# Altium project JSP016RB.PrjPCB
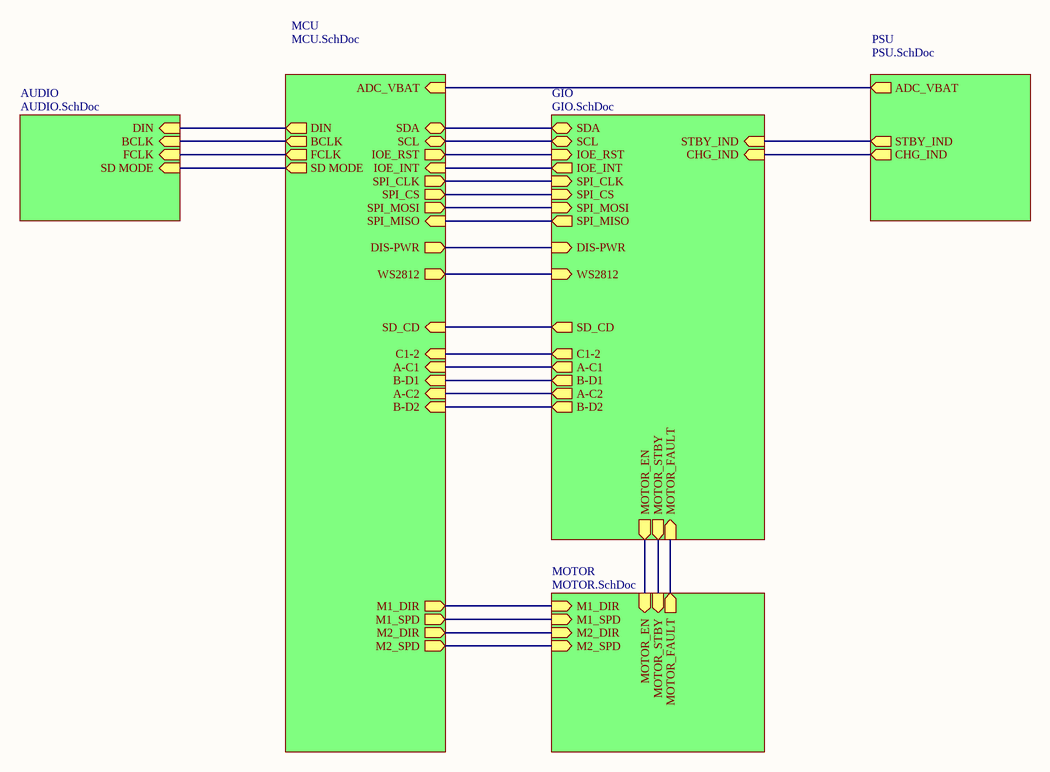
[diagram p0: JSP016.SchDoc]
6 sheets, 164 parts. Net scope: hierarchical (ports join the sheet entries above them; power ports are global).
Board file: JSP016RB.PcbDoc
Sheets:
  JSP016.SchDoc
    MCU = MCU.SchDoc
    AUDIO = AUDIO.SchDoc
    PSU = PSU.SchDoc
    MOTOR = MOTOR.SchDoc
    GIO = GIO.SchDoc

## Sheet JSP016.SchDoc: ROBOX V2 - General Overview
size A4; DrawnBy: Jan Stappers; DocumentNumber: JSP016; Revision: B; SheetNumber: 1; SheetTotal: 6

### Sub-sheets
AUDIO = AUDIO.SchDoc: BCLK (in), SD MODE (in), DIN (in), FCLK (in)
GIO = GIO.SchDoc: SD_CD (out), SPI_CLK (in), SCL (bidir), SPI_CS (in), STBY_IND (in), WS2812 (in), SDA (bidir), SPI_MOSI (in), SPI_MISO (out), IOE_RST (in), A-C1 (out), B-D1 (out), C1-2 (out), MOTOR_EN (out), DIS-PWR (in), MOTOR_STBY (out), CHG_IND (in), A-C2 (out), B-D2 (out), IOE_INT (out), MOTOR_FAULT (in)
MCU = MCU.SchDoc: FCLK (out), SD_CD (in), SPI_CLK (out), SDA (bidir), WS2812 (out), SPI_MISO (in), SPI_MOSI (out), SD MODE (out), SCL (bidir), DIN (out), DIS-PWR (out), BCLK (out), M1_DIR (out), M2_DIR (out), M2_SPD (out), M1_SPD (out), SPI_CS (out), IOE_RST (out), A-C1 (in), B-D1 (in), C1-2 (in), A-C2 (in), B-D2 (in), IOE_INT (in), ADC_VBAT (in)
MOTOR = MOTOR.SchDoc: M2_SPD (in), M2_DIR (in), M1_SPD (in), M1_DIR (in), MOTOR_STBY (in), MOTOR_EN (in), MOTOR_FAULT (out)
PSU = PSU.SchDoc: CHG_IND (out), STBY_IND (out), ADC_VBAT (out)

### Nets
DIS-PWR: sheet MCU/DIS-PWR, sheet GIO/DIS-PWR
NetC34_2: sheet MCU/ADC_VBAT, sheet PSU/ADC_VBAT
NetC49_1: sheet MOTOR/MOTOR_STBY, sheet GIO/MOTOR_STBY
NetIC1_1: sheet MCU/DIN, sheet AUDIO/DIN
NetIC1_4: sheet MCU/SD MODE, sheet AUDIO/SD MODE
NetIC1_14: sheet MCU/FCLK, sheet AUDIO/FCLK
NetIC1_16: sheet MCU/BCLK, sheet AUDIO/BCLK
NetIC3_4: sheet MCU/C1-2, sheet GIO/C1-2
NetIC3_5: sheet MCU/A-C2, sheet GIO/A-C2
NetIC3_6: sheet MCU/B-D2, sheet GIO/B-D2
NetIC3_7: sheet MCU/IOE_INT, sheet GIO/IOE_INT
NetIC3_9: sheet MCU/A-C1, sheet GIO/A-C1
NetIC3_10: sheet MCU/B-D1, sheet GIO/B-D1
NetIC3_22: sheet MCU/SD_CD, sheet GIO/SD_CD
NetIC3_25: sheet MCU/M1_DIR, sheet MOTOR/M1_DIR
NetIC3_26: sheet MCU/M2_DIR, sheet MOTOR/M2_DIR
NetIC3_29: sheet MCU/SPI_CS, sheet GIO/SPI_CS
NetIC3_30: sheet MCU/SPI_CLK, sheet GIO/SPI_CLK
NetIC3_31: sheet MCU/SPI_MOSI, sheet GIO/SPI_MOSI
NetIC3_32: sheet MCU/SPI_MISO, sheet GIO/SPI_MISO
NetIC3_33: sheet MCU/M1_SPD, sheet MOTOR/M1_SPD
NetIC3_34: sheet MCU/M2_SPD, sheet MOTOR/M2_SPD
NetIC8_6: sheet PSU/STBY_IND, sheet GIO/STBY_IND
NetIC8_7: sheet PSU/CHG_IND, sheet GIO/CHG_IND
NetIC10_3: sheet MCU/IOE_RST, sheet GIO/IOE_RST
NetIC10_15: sheet MOTOR/MOTOR_EN, sheet GIO/MOTOR_EN
NetIC10_17: sheet MOTOR/MOTOR_FAULT, sheet GIO/MOTOR_FAULT
NetIC10_22: sheet MCU/SCL, sheet GIO/SCL
NetIC10_23: sheet MCU/SDA, sheet GIO/SDA
NetIC11_1: sheet MCU/WS2812, sheet GIO/WS2812

### Notes on the sheet
- Title
- Size:
- Date:
- A4
- Number:
- Time:
- Revision:
- Sheet
- of
- File:

## Sheet MCU.SchDoc: ROBOX V2 - Microcontroller
size A4; DrawnBy: Jan Stappers; DocumentNumber: JSP016; Revision: B; SheetNumber: 2; SheetTotal: 6
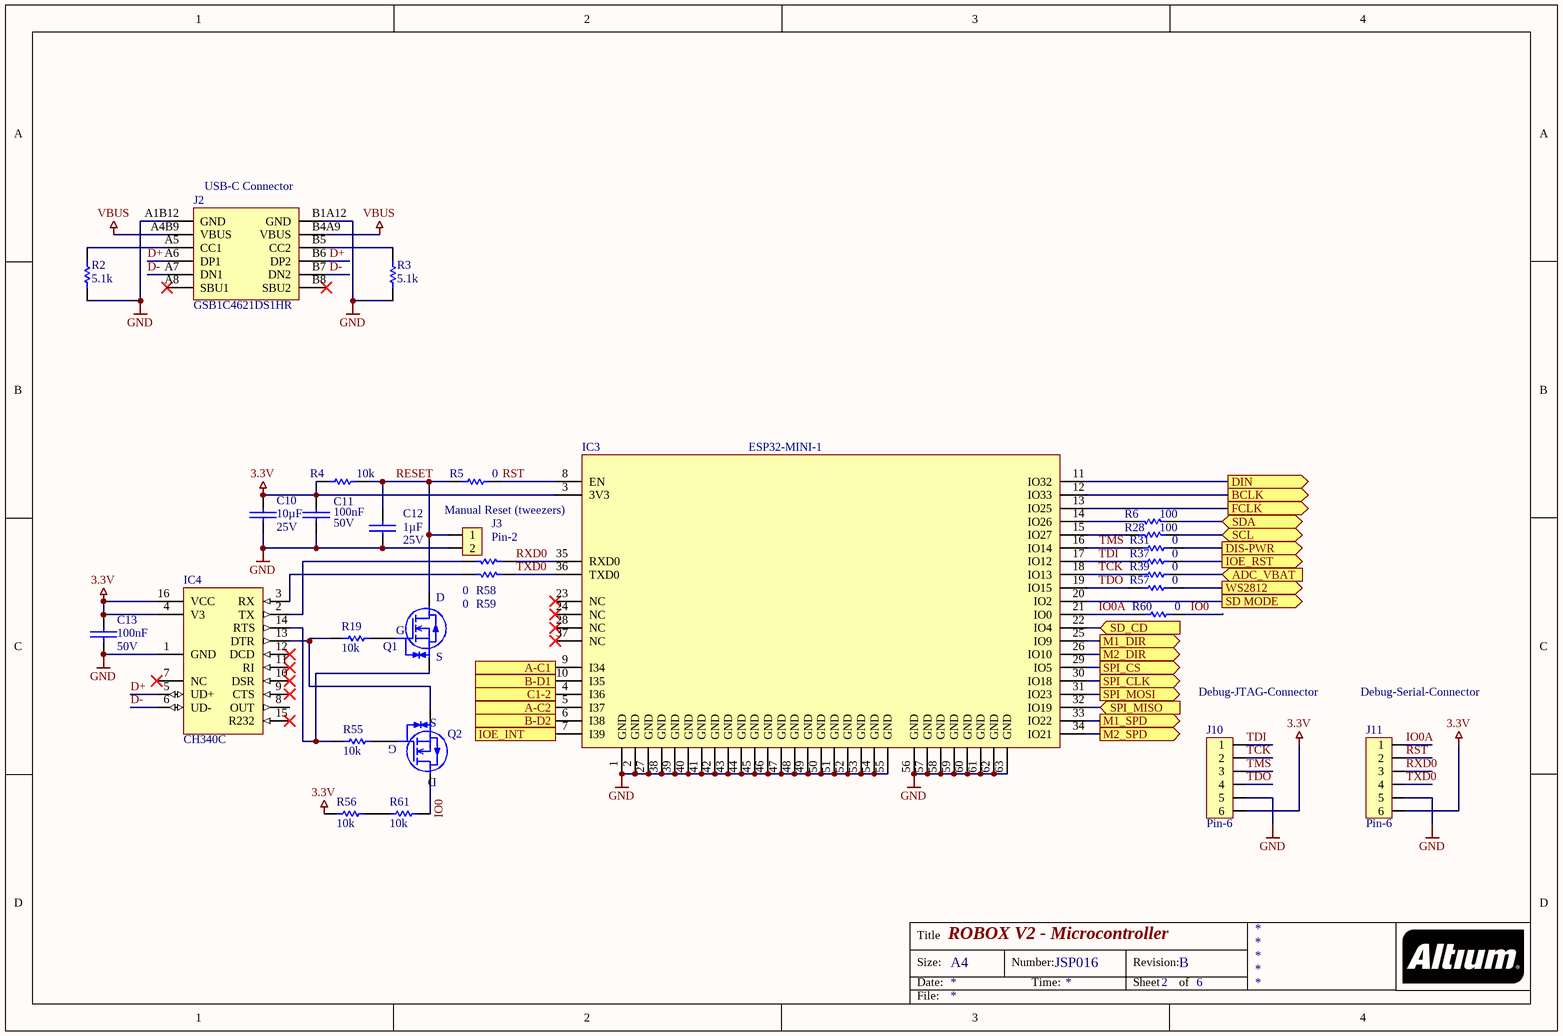
[diagram p1: MCU.SchDoc]

### Parts
C10  value 10µF  voltage: 25V  [C0603]  (hidden comment: cap_non_pol)
C11  value 100nF  voltage: 50V  [C0402]  (hidden comment: cap_non_pol)
C12  value 1µF  voltage: 25V  [C0603]  (hidden comment: cap_non_pol)
C13  value 100nF  voltage: 50V  [TH5.08]  (hidden comment: cap_non_pol)
IC3  ESP32-MINI-1  [ESP32-MINI-1]
IC4  CH340C  [SOP-16]
J2  GSB1C4621DS1HR  [GSB1C4621DS1HR]
J3  Pin-2  [2-PIN-EMPTY]
J10  Pin-6  [6-PIN-EMPTY]
J11  Pin-6  [6-PIN-EMPTY]
Q1  N_CH_MOSFET  [SOT-23(-3)]  (value not drawn)
Q2  N_CH_MOSFET  [SOT-23(-3)]  (value not drawn)
R2  value 5.1k  [R0402]  (hidden comment: resistor)
R3  value 5.1k  [R0402]  (hidden comment: resistor)
R4  value 10k  [R0402]  (hidden comment: resistor)
R5  value 0  [R0402]  (hidden comment: resistor)
R6  value 100  [R0402]  (hidden comment: resistor)
R19  value 10k  [R0402]  (hidden comment: resistor)
R28  value 100  [R0402]  (hidden comment: resistor)
R31  value 0  [R0402]  (hidden comment: resistor)
R37  value 0  [R0402]  (hidden comment: resistor)
R39  value 0  [R0402]  (hidden comment: resistor)
R55  value 10k  [R0402]  (hidden comment: resistor)
R56  value 10k  [R0402]  (hidden comment: resistor)
R57  value 0  [R0402]  (hidden comment: resistor)
R58  value 0  [R0402]  (hidden comment: resistor)
R59  value 0  [R0402]  (hidden comment: resistor)
R60  value 0  [R0402]  (hidden comment: resistor)
R61  value 10k  [R0402]  (hidden comment: resistor)

### Ports
A-C1 (in), A-C2 (in), ADC_VBAT (in), B-D1 (in), B-D2 (in), BCLK (out), C1-2 (in), DIN (out), DIS-PWR (out), FCLK (out), IOE_INT (in), IOE_RST (out), M1_DIR (out), M1_SPD (out), M2_DIR (out), M2_SPD (out), SCL (bidir), SD MODE (out), SD_CD (in), SDA (bidir), SPI_CLK (out), SPI_CS (out), SPI_MISO (in), SPI_MOSI (out), WS2812 (out)

### Nets
3.3V: C10.1 C11.2 C13.1 IC3.3(3V3) IC4.4(V3) IC4.16(VCC) J10.6 J11.6 R4.2 R56.1
GND: C10.2 C11.1 C12.2 C13.2 IC3.1(GND) IC3.2(GND) IC3.27(GND) IC3.38(GND) IC3.39(GND) IC3.40(GND) IC3.41(GND) IC3.42(GND) IC3.43(GND) IC3.44(GND) IC3.45(GND) IC3.46(GND) IC3.47(GND) IC3.48(GND) IC3.49(GND) IC3.50(GND) IC3.51(GND) IC3.52(GND) IC3.53(GND) IC3.54(GND) IC3.55(GND) IC3.56(GND) IC3.57(GND) IC3.58(GND) IC3.59(GND) IC3.60(GND) IC3.61(GND) IC3.62(GND) IC3.63(GND) IC4.1(GND) J2.A1B12(GND) J2.B1A12(GND) J3.2 J10.5 J11.5 R2.2 R3.2
VBUS: J2.A4B9(VBUS) J2.B4A9(VBUS)
D+: IC4.5(UD+) J2.A6(DP1) J2.B6(DP2)
D-: IC4.6(UD-) J2.A7(DN1) J2.B7(DN2)
DIS-PWR: R31.1 ; port DIS-PWR
IO0: Q2.3(D) R60.1 R61.2
IO0A: IC3.21(IO0) J11.1 R60.2
RESET: C12.1 J3.1 Q1.3(D) R4.1 R5.2
RST: IC3.8(EN) J11.2 R5.1
RXD0: IC3.35(RXD0) J11.3 R58.1
TCK: IC3.18(IO13) J10.2 R39.2
TDI: IC3.17(IO12) J10.1 R37.2
TDO: IC3.19(IO15) J10.4 R57.2
TMS: IC3.16(IO14) J10.3 R31.2
TXD0: IC3.36(TXD0) J11.4 R59.1
NetC34_2: R39.1 ; port ADC_VBAT
NetIC1_1: IC3.11(IO32) ; port DIN
NetIC1_4: IC3.20(IO2) ; port SD MODE
NetIC1_14: IC3.13(IO25) ; port FCLK
NetIC1_16: IC3.12(IO33) ; port BCLK
NetIC3_4: IC3.4(I36) ; port C1-2
NetIC3_5: IC3.5(I37) ; port A-C2
NetIC3_6: IC3.6(I38) ; port B-D2
NetIC3_7: IC3.7(I39) ; port IOE_INT
NetIC3_9: IC3.9(I34) ; port A-C1
NetIC3_10: IC3.10(I35) ; port B-D1
NetIC3_14: IC3.14(IO26) R6.1
NetIC3_15: IC3.15(IO27) R28.1
NetIC3_22: IC3.22(IO4) ; port SD_CD
NetIC3_25: IC3.25(IO9) ; port M1_DIR
NetIC3_26: IC3.26(IO10) ; port M2_DIR
NetIC3_29: IC3.29(IO5) ; port SPI_CS
NetIC3_30: IC3.30(IO18) ; port SPI_CLK
NetIC3_31: IC3.31(IO23) ; port SPI_MOSI
NetIC3_32: IC3.32(IO19) ; port SPI_MISO
NetIC3_33: IC3.33(IO22) ; port M1_SPD
NetIC3_34: IC3.34(IO21) ; port M2_SPD
NetIC4_2: IC4.2(TX) R58.2
NetIC4_3: IC4.3(RX) R59.2
NetIC4_13: IC4.13(DTR) Q2.2(S) R19.1
NetIC4_14: IC4.14(RTS) Q1.2(S) R55.1
NetIC10_3: R37.1 ; port IOE_RST
NetIC10_22: R28.2 ; port SCL
NetIC10_23: R6.2 ; port SDA
NetIC11_1: R57.1 ; port WS2812
NetJ2_A5: J2.A5(CC1) R2.1
NetJ2_B5: J2.B5(CC2) R3.1
NetQ1_1: Q1.1(G) R19.2
NetQ2_1: Q2.1(G) R55.2
NetR56_2: R56.2 R61.1

Not connected (* = marked no-connect by the designer): IC3 23(NC)* 24(NC)* 28(NC)* 37(NC)*; IC4 7(NC)* 8(OUT) 9(CTS)* 10(DSR)* 11(RI)* 12(DCD)* 15(R232)*; J2 A8(SBU1)* B8(SBU2)*

### Notes on the sheet
- (near J2) USB-C Connector
- (near IC3) Manual Reset (tweezers)
- (near J10) Debug-JTAG-Connector
- (near J11) Debug-Serial-Connector
- Title
- Size:
- Date:
- A4
- Number:
- Time:
- Revision:
- Sheet
- of
- File:

### Library data of the parts
C10 = 1: CAP CER 10UF 25V X5R 10% SMD; manufacturer_ref: GRM188R61E106KA73D; manufacturer: Murata Electronics; id: 1; tolerance: 10%; dielectric: X5R; package: 0603; supplier_1: digikey; supplier_1_partnumber: 490-18214-1-ND; price: 0,06969; status: active
C11 = 0: CAP CER 0.1UF 50V X5R 0402; manufacturer_ref: 490-16356-1-ND; manufacturer: Murata Electronics; id: 0; tolerance: 5%; dielectric: X5R; package: 0402; supplier_1: digikey; supplier_1_partnumber: 490-16356-1-ND; price: 0,00933; status: non stock
C12 = 34: CAP CER 1UF 25V X5R 0603; manufacturer_ref: CC0603KRX5R8BB105; manufacturer: YAGEO; id: 34; tolerance: 10%; dielectric: X5R; package: 0603; supplier_1: digikey; supplier_1_partnumber: 311-1445-1-ND; price: 0,01837; status: active
C13 = 51: CAP CER TH 100nF X7R 50V; manufacturer_ref: C2761753; manufacturer: FH; id: 51; tolerance: 10%; dielectric: X7R; package: TH5.08; supplier_1: lcsc; supplier_1_partnumber: C385200; price: 0,0237; status: active
IC3 = 80: RF TXRX MOD BT TRACE ANT CHAS MT; manufacturer_ref: ESP32-MINI-1-N4; manufacturer: Espressif Systems; id: 80; type: MCU Wireless (Bluetooth); package: 63-SMD; supplier_1: digikey; supplier_1_partnumber: 1965-ESP32-MINI-1-N4CT-ND; price: 2,12; status: active
IC4 = 79: 2Mbps Transceiver USB 2.0 SOP-16 USB ICs ROHS; manufacturer: WCH(Jiangsu Qin Heng); id: 79; manufacturer_ref: CH340C; type: Wired (USB TO SERIAL); package: 16-SOP; supplier_1: lcsc; supplier_1_partnumber: C84681; price: 0,4996; status: active
J2 = 55: USB2.0, TYPE C, MID MOUNT, CENTE; manufacturer: Amphenol ICC (Commercial Products); id: 55; nbr_positions_total: 16; manufacturer_ref: GSB1C4621DS1HR; package: Pin-16DR; supplier_1: digikey; supplier_1_partnumber: 664-GSB1C4621DS1HRCT-ND; price: 0,52; status: active
J3 = 18: CONN TH solder pad; manufacturer_ref: TH-2; id: 18; nbr_positions_total: 2; package: Pin-2SR; price: 0
J10 J11 = 60: CONN TH solder pad; manufacturer_ref: 6-Pin TH; id: 60; nbr_positions_total: 6; package: Pin-6SR; price: 0; status: active
Q1 Q2 = 7: MOSFET N-CH 100V 170MA SOT23-3; manufacturer_ref: BSS123-7-F; manufacturer: Diodes Incorporated; id: 7; current_rating: 0.170A; voltage_vgs_min: 20V; type: N channel; voltage_vds: 100V; package: SOT23-3; supplier_1: digikey; supplier_1_partnumber: NTR4003NT1GOSCT-ND; price: 0,0395; status: active
R2 R3 = 94: RES 5.1K OHM 1% 1/16W 0402; manufacturer_ref: RMCF0402FT5K10; manufacturer: Stackpole Electronics Inc; id: 94; tolerance: 1%; power: 1/16W; package: 0402; supplier_1: digikey; supplier_1_partnumber: RMCF0402FT5K10CT-ND; price: 0,09; status: active
R4 R19 R55 R56 R61 = 6: RES SMD 10K OHM 1% 1/10W 0402; manufacturer_ref: ERJ-2RKF1002X; manufacturer: Panasonic Electronic Components; id: 6; tolerance: 1%; power: 1/10W; package: 0402; supplier_1: digikey; supplier_1_partnumber: P10.0KLCT-ND; price: 0,00703; status: active
R5 R31 R37 R39 R57-R60 = 8: RES SMD 0 OHM JUMPER 1/10W 0402; manufacturer_ref: ERJ-2GE0R00X; manufacturer: Panasonic Electronic Components; id: 8; tolerance: 1%; power: 1/10W; package: 0402; supplier_1: digikey; supplier_1_partnumber: P0.0JCT-ND; price: 0,00487; status: active
R6 R28 = 29: RES SMD 100 OHM 1% 1/5W 0402; manufacturer_ref: CRCW0402100RFKEDHP; manufacturer: Vishay Dale; id: 29; tolerance: 1%; power: 1/5W; package: 0402; supplier_1: digikey; supplier_1_partnumber: 541-100YCT-ND; price: 0,01933; status: active

## Sheet AUDIO.SchDoc: ROBOX V2 - Audio Amplifier
size A4; DrawnBy: Jan Stappers; DocumentNumber: JSP016; Revision: B; SheetNumber: 3; SheetTotal: 6
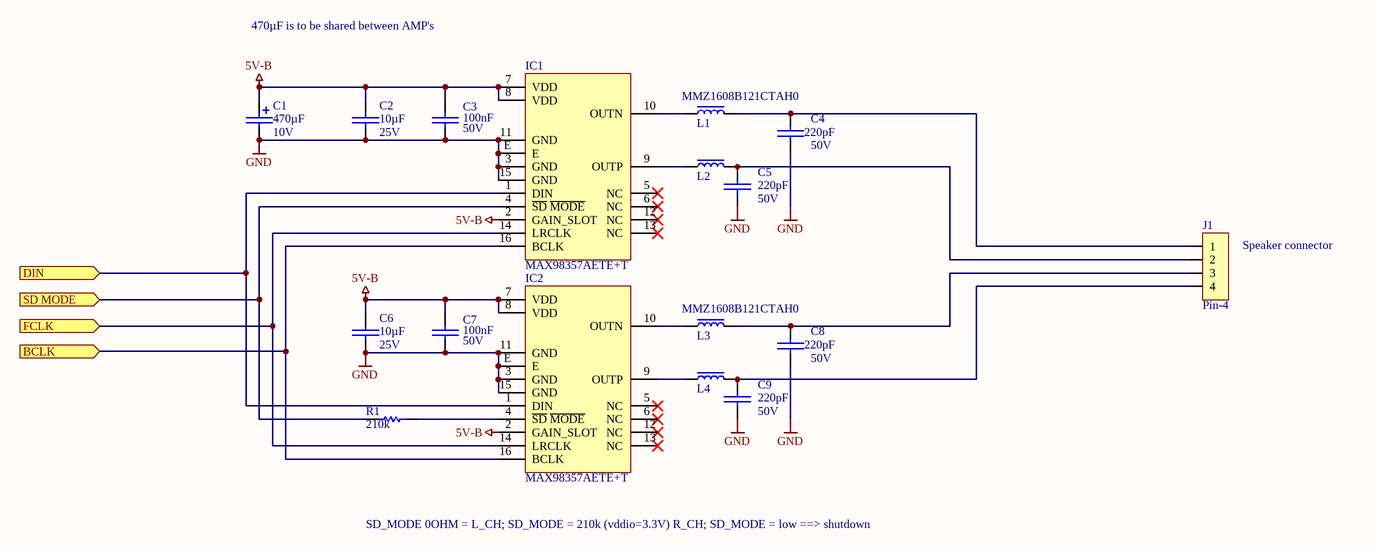
[diagram p2: AUDIO.SchDoc]

### Parts
C1  value 470µF  voltage: 10V  [CD6.3H12TH]  (hidden comment: cap-pol)
C2  value 10µF  voltage: 25V  [C0603]  (hidden comment: cap_non_pol)
C3  value 100nF  voltage: 50V  [C0402]  (hidden comment: cap_non_pol)
C4  value 220pF  voltage: 50V  [TH5.08]  (hidden comment: cap_non_pol)
C5  value 220pF  voltage: 50V  [TH5.08]  (hidden comment: cap_non_pol)
C6  value 10µF  voltage: 25V  [C0603]  (hidden comment: cap_non_pol)
C7  value 100nF  voltage: 50V  [C0402]  (hidden comment: cap_non_pol)
C8  value 220pF  voltage: 50V  [TH5.08]  (hidden comment: cap_non_pol)
C9  value 220pF  voltage: 50V  [TH5.08]  (hidden comment: cap_non_pol)
IC1  MAX98357AETE+T  [TQFN-16]
IC2  MAX98357AETE+T  [TQFN-16]
J1  Pin-4  [110990030]
L1  manufacturer_ref: MMZ1608B121CTAH0  [FB0603]  (hidden comment: ferrite_bead)
L2  ferrite_bead  [FB0603]  (value not drawn)
L3  manufacturer_ref: MMZ1608B121CTAH0  [FB0603]  (hidden comment: ferrite_bead)
L4  ferrite_bead  [FB0603]  (value not drawn)
R1  value 210k  [R0402]  (hidden comment: resistor)

### Ports
BCLK (in), DIN (in), FCLK (in), SD MODE (in)

### Nets
5V-B: C1.+ C2.1 C3.2 C6.1 C7.2 IC1.2(GAIN_SLOT) IC1.7(VDD) IC1.8(VDD) IC2.2(GAIN_SLOT) IC2.7(VDD) IC2.8(VDD)
GND: C1.- C2.2 C3.1 C4.2 C5.2 C6.2 C7.1 C8.2 C9.2 IC1.3(GND) IC1.11(GND) IC1.15(GND) IC1.E IC2.3(GND) IC2.11(GND) IC2.15(GND) IC2.E
NetC4_1: C4.1 J1.1 L1.2
NetC5_1: C5.1 J1.2 L2.2
NetC8_1: C8.1 J1.3 L3.2
NetC9_1: C9.1 J1.4 L4.2
NetIC1_1: IC1.1(DIN) IC2.1(DIN) ; port DIN
NetIC1_4: IC1.4(~{SD}_~{MODE}) R1.2 ; port SD MODE
NetIC1_9: IC1.9(OUTP) L2.1
NetIC1_10: IC1.10(OUTN) L1.1
NetIC1_14: IC1.14(LRCLK) IC2.14(LRCLK) ; port FCLK
NetIC1_16: IC1.16(BCLK) IC2.16(BCLK) ; port BCLK
NetIC2_4: IC2.4(~{SD}_~{MODE}) R1.1
NetIC2_9: IC2.9(OUTP) L4.1
NetIC2_10: IC2.10(OUTN) L3.1

Not connected (* = marked no-connect by the designer): IC1 5(NC)* 6(NC)* 12(NC)* 13(NC)*; IC2 5(NC)* 6(NC)* 12(NC)* 13(NC)*

### Notes on the sheet
- 470µF is to be shared between AMP's
- (near J1) Speaker connector
- SD_MODE 0OHM = L_CH; SD_MODE = 210k (vddio=3.3V) R_CH; SD_MODE = low ==> shutdown
- Title
- Size:
- Date:
- A4
- Number:
- Time:
- Revision:
- Sheet
- of
- File:

### Library data of the parts
C1 = 4: CAP ALUM 470UF 20% 10V TH; manufacturer_ref: EGH1AM471E12OT; manufacturer: AISHI(Aihua Group); id: 4; dielectric: Aluminium; tolerance: 20%; package: d6.3h12TH; supplier_1: lcsc; supplier_1_partnumber: C2924460; price: 0,0391; status: active
C2 C6 = 1: as C10 on sheet MCU; tolerance: 10%; dielectric: X5R; package: 0603; supplier_1: digikey; supplier_1_partnumber: 490-18214-1-ND; price: 0,06969; status: active
C3 C7 = 0: as C11 on sheet MCU; dielectric: X5R; package: 0402; supplier_1: digikey; supplier_1_partnumber: 490-16356-1-ND; price: 0,00933; status: non stock
C4 C5 C8 C9 = 52: CAP CER TH 220pF NP0 50V; manufacturer: WMEC; id: 52; tolerance: 5%; dielectric: X7R; package: TH5.08; supplier_1: lcsc; supplier_1_partnumber: C2761745; price: 0,0237; status: active
IC1 IC2 = 91: IC AMP CLASS D MONO 3.2W 16TQFN; manufacturer: Maxim Integrated; id: 91; manufacturer_ref: MAX98357A; type: Amplifier; package: 16-TQFN; supplier_1: digikey; supplier_1_partnumber: MAX98357AETE+TCT-ND; status: active
J1 = 58: GROVE 2MM 4PIN VERT CONN 10PCS; manufacturer: Seeed Technology Co., Ltd; id: 58; nbr_positions_total: 4; manufacturer_ref: 110990030; package: Pin-4SR; supplier_1: digikey; supplier_1_partnumber: 1597-1082-ND; price: 0,157; status: active
L1 L3 = 4: FERRITE BEAD 120 OHM 0603 1LN; manufacturer: TDK Corporation; id: 4; impedance: 120; dc_resistance: 0.15; current_rating: 0.6A; package: 0603; supplier_1: digikey; supplier_1_partnumber: 445-MMZ1608B121CTAH0CT-ND; price: 0,064; status: active
L2 L4 = 4: FERRITE BEAD 120 OHM 0603 1LN; manufacturer_ref: MMZ1608B121CTAH0; manufacturer: TDK Corporation; id: 4; impedance: 120; dc_resistance: 0.15; current_rating: 0.6A; package: 0603; supplier_1: digikey; supplier_1_partnumber: 445-MMZ1608B121CTAH0CT-ND; price: 0,064; status: active
R1 = 93: RES 210K OHM 1% 1/16W 0402; manufacturer_ref: RC0402FR-07210KL; manufacturer: YAGEO; id: 93; tolerance: 1%; power: 1/16W; package: 0402; supplier_1: digikey; supplier_1_partnumber: 311-210KLRCT-ND; price: 0,014; status: active

## Sheet PSU.SchDoc: ROBOX V2 - Power Supply
size A4; DrawnBy: Jan Stappers; DocumentNumber: JSP016; Revision: B; SheetNumber: 4; SheetTotal: 6
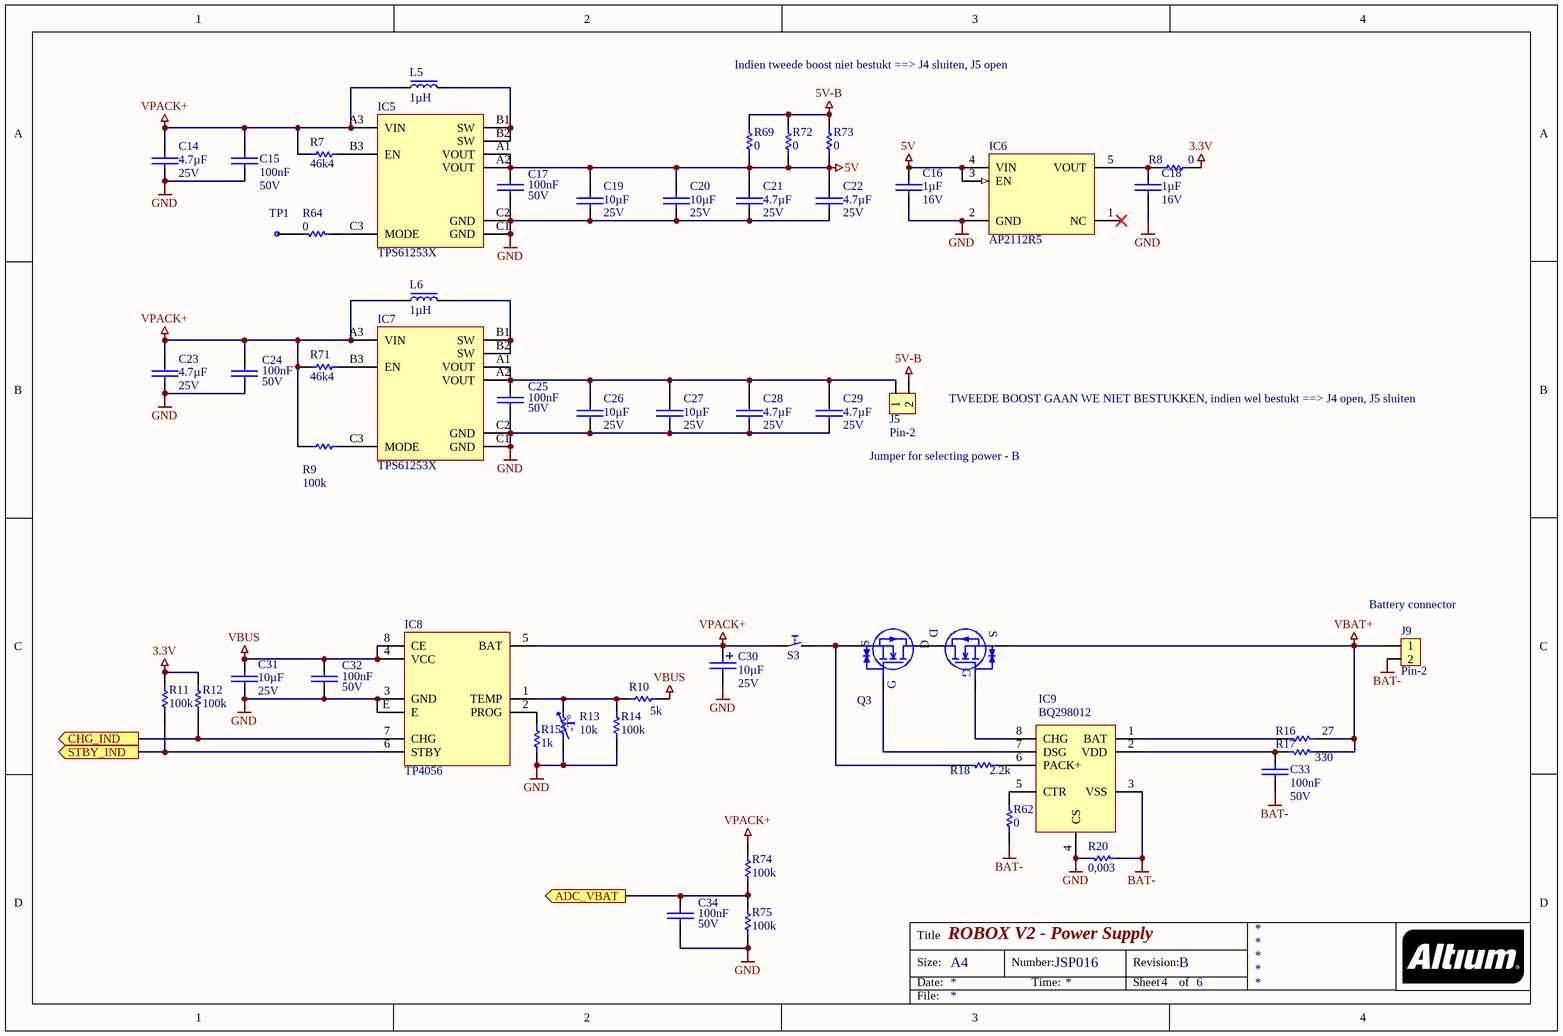
[diagram p3: PSU.SchDoc]

### Parts
C14  value 4.7µF  voltage: 25V  [C0805]  (hidden comment: cap_non_pol)
C15  value 100nF  voltage: 50V  [C0402]  (hidden comment: cap_non_pol)
C16  value 1µF  voltage: 16V  [C0402]  (hidden comment: cap_non_pol)
C17  value 100nF  voltage: 50V  [C0402]  (hidden comment: cap_non_pol)
C18  value 1µF  voltage: 16V  [C0402]  (hidden comment: cap_non_pol)
C19  value 10µF  voltage: 25V  [C0603]  (hidden comment: cap_non_pol)
C20  value 10µF  voltage: 25V  [C0603]  (hidden comment: cap_non_pol)
C21  value 4.7µF  voltage: 25V  [C0805]  (hidden comment: cap_non_pol)
C22  value 4.7µF  voltage: 25V  [C0805]  (hidden comment: cap_non_pol)
C23  value 4.7µF  voltage: 25V  [C0805]  (hidden comment: cap_non_pol)
C24  value 100nF  voltage: 50V  [C0402]  (hidden comment: cap_non_pol)
C25  value 100nF  voltage: 50V  [C0402]  (hidden comment: cap_non_pol)
C26  value 10µF  voltage: 25V  [C0603]  (hidden comment: cap_non_pol)
C27  value 10µF  voltage: 25V  [C0603]  (hidden comment: cap_non_pol)
C28  value 4.7µF  voltage: 25V  [C0805]  (hidden comment: cap_non_pol)
C29  value 4.7µF  voltage: 25V  [C0805]  (hidden comment: cap_non_pol)
C30  value 10µF  voltage: 25V  [CD6.3H12TH]  (hidden comment: cap-pol)
C31  value 10µF  voltage: 25V  [C0603]  (hidden comment: cap_non_pol)
C32  value 100nF  voltage: 50V  [C0402]  (hidden comment: cap_non_pol)
C33  value 100nF  voltage: 50V  [TH5.08]  (hidden comment: cap_non_pol)
C34  value 100nF  voltage: 50V  [C0402]  (hidden comment: cap_non_pol)
IC5  TPS61253X  [DSBGA-9]
IC6  AP2112R5  [SOT-89-5]
IC7  TPS61253X  [DSBGA-9]
IC8  TP4056  [SOIC-8-E]
IC9  BQ298012  [XFQFN-8]
J5  Pin-2  [2-PIN-EMPTY]
J9  Pin-2  [B075TZF7NN]
L5  value 1µH  [L4.2X4.2X2]  (hidden comment: inductor_1)
L6  value 1µH  [L4.2X4.2X2]  (hidden comment: inductor_1)
Q3  N_CH_MOSFET2_DUAL  [CSP-6]  (value not drawn)
R7  value 46k4  [R0402]  (hidden comment: resistor)
R8  value 0  [R0402]  (hidden comment: resistor)
R9  value 100k  [R0402]  (hidden comment: resistor)
R10  value 5k  [R0402]  (hidden comment: resistor)
R11  value 100k  [TH6.3]  (hidden comment: resistor)
R12  value 100k  [TH6.3]  (hidden comment: resistor)
R13  value 10k  [R0402]  (hidden comment: thermistor)
R14  value 100k  [R0402]  (hidden comment: resistor)
R15  value 1k  [R0402]  (hidden comment: resistor)
R16  value 27  [R0402]  (hidden comment: resistor)
R17  value 330  [R0402]  (hidden comment: resistor)
R18  value 2.2k  [R0402]  (hidden comment: resistor)
R20  value 0,003  [R2010]  (hidden comment: resistor)
R62  value 0  [R0402]  (hidden comment: resistor)
R64  value 0  [R0402]  (hidden comment: resistor)
R69  value 0  [R0402]  (hidden comment: resistor)
R71  value 46k4  [R0402]  (hidden comment: resistor)
R72  value 0  [R0402]  (hidden comment: resistor)
R73  value 0  [R0402]  (hidden comment: resistor)
R74  value 100k  [R0402]  (hidden comment: resistor)
R75  value 100k  [R0402]  (hidden comment: resistor)
S3  push-button  [ANT11SF1CQE]  (value not drawn)
TP1  TP  [TP_0.8MM]  (value not drawn)

### Ports
ADC_VBAT (out), CHG_IND (out), STBY_IND (out)

### Nets
3.3V: R8.1 R11.1 R12.1
5V: C16.1 C17.2 C19.1 C20.1 C21.1 C22.1 IC5.A1(VOUT) IC5.A2(VOUT) IC6.3(EN) IC6.4(VIN) R69.2 R72.2 R73.2
5V-B: J5.2 R69.1 R72.1 R73.1
BAT-: C33.2 IC9.3(VSS) J9.2 R20.2 R62.2
GND: C14.2 C15.2 C16.2 C17.1 C18.2 C19.2 C20.2 C21.2 C22.2 C23.2 C24.1 C25.1 C26.2 C27.2 C28.2 C29.2 C30.- C31.2 C32.1 C34.1 IC5.C1(GND) IC5.C2(GND) IC6.2(GND) IC7.C1(GND) IC7.C2(GND) IC8.3(GND) IC8.E IC9.4(CS) R13.1 R14.2 R15.2 R20.1 R75.2
VBAT+: J9.1 Q3.S R16.2 R17.2
VBUS: C31.1 C32.2 IC8.4(VCC) IC8.8(CE) R10.2
VPACK+: C14.1 C15.1 C23.1 C24.2 C30.+ IC5.A3(VIN) IC7.A3(VIN) IC8.5(BAT) L5.1 L6.1 R7.1 R9.2 R71.1 R74.1 S3.1
NetC18_1: C18.1 IC6.5(VOUT) R8.2
NetC25_2: C25.2 C26.1 C27.1 C28.1 C29.1 IC7.A1(VOUT) IC7.A2(VOUT) J5.1
NetC33_1: C33.1 IC9.2(VDD) R17.1
NetC34_2: C34.2 R74.2 R75.1 ; port ADC_VBAT
NetIC5_B1: IC5.B1(SW) IC5.B2(SW) L5.2
NetIC5_B3: IC5.B3(EN) R7.2
NetIC5_C3: IC5.C3(MODE) R64.1
NetIC7_B1: IC7.B1(SW) IC7.B2(SW) L6.2
NetIC7_B3: IC7.B3(EN) R71.2
NetIC7_C3: IC7.C3(MODE) R9.1
NetIC8_1: IC8.1(TEMP) R10.1 R13.2 R14.1
NetIC8_2: IC8.2(PROG) R15.1
NetIC8_6: IC8.6(STBY) R11.2 ; port STBY_IND
NetIC8_7: IC8.7(CHG) R12.2 ; port CHG_IND
NetIC9_1: IC9.1(BAT) R16.1
NetIC9_5: IC9.5(CTR) R62.1
NetIC9_6: IC9.6(PACK+) R18.2
NetIC9_7: IC9.7(DSG) Q3.G2
NetIC9_8: IC9.8(CHG) Q3.G
NetQ3_S2: Q3.S2 R18.1 S3.2
NetR64_2: R64.2 TP1.1

Not connected (* = marked no-connect by the designer): IC6 1(NC)*

### Notes on the sheet
- Indien tweede boost niet bestukt ==> J4 sluiten, J5 open
- (near J5) TWEEDE BOOST GAAN WE NIET BESTUKKEN, indien wel bestukt ==> J4 open, J5 sluiten
- Jumper for selecting power - B
- (near J9) Battery connector
- Title
- Size:
- Date:
- A4
- Number:
- Time:
- Revision:
- Sheet
- of
- File:
- (in symbol 1) -T°
- (in symbol 18) D

### Library data of the parts
C14 C21-C23 C28 C29 = 44: CAP CER 4.7UF 25V X5R 0805; manufacturer_ref: CL21A475KAQNNNE; manufacturer: Samsung Electro-Mechanics; id: 44; tolerance: 10%; dielectric: X5R; package: 0805; supplier_1: digikey; supplier_1_partnumber: 1276-1244-1-ND; price: 0,0374; status: active
C15 C17 C24 C25 C32 C34 = 0: as C11 on sheet MCU; dielectric: X5R; package: 0402; supplier_1: digikey; supplier_1_partnumber: 490-16356-1-ND; price: 0,00933; status: non stock
C16 C18 = 5: CAP CER 1UF 16V X5R 0402; manufacturer_ref: CL05A105KO5NNNC; manufacturer: Samsung Electro-Mechanics; id: 5; tolerance: 10%; dielectric: X5R; package: 0402; supplier_1: digikey; supplier_1_partnumber: 1276-1067-1-ND; price: 0,00898; status: active
C19 C20 C26 C27 C31 = 1: as C10 on sheet MCU; tolerance: 10%; dielectric: X5R; package: 0603; supplier_1: digikey; supplier_1_partnumber: 490-18214-1-ND; price: 0,06969; status: active
C30 = 6: CAP ALUM 10UF 20% 25V TH; manufacturer_ref: ECF1KM100E12OTPO; manufacturer: Yunxing; id: 6; dielectric: Aluminium; tolerance: 20%; package: d6,3h12TH; supplier_1: lcsc; supplier_1_partnumber: C2841587; price: 0,0229; status: active
C33 = 51: as C13 on sheet MCU; dielectric: X7R; package: TH5.08; supplier_1: lcsc; supplier_1_partnumber: C385200; price: 0,0237; status: active
IC5 IC7 = 84: 3.8-MHZ, 5.25-V / 4-A BOOST CONV; manufacturer_ref: TPS61253E; manufacturer: Texas Instruments; id: 84; type: Power Supply DC/DC (BOOST); package: 9-DSBGA; supplier_1: digikey; supplier_1_partnumber: 296-TPS61253EYFFRCT-ND; price: 0,92; status: active
IC6 = 85: IC REG LINEAR 3.3V 600MA SOT89-5; manufacturer_ref: AP2112R5-3.3TRG1; manufacturer: Diodes Incorporated; id: 85; type: Power Supply LDO; package: SOT-89-5; supplier_1: digikey; supplier_1_partnumber: 31-AP2112R5-3.3TRG1CT-ND; status: active
IC8 = 89: IC ESOP-8 Battery Charger Management; manufacturer_ref: TP4056-42-ESOP8; manufacturer: TOPPOWER; id: 89; type: Power Supply (Bat Charg); package: 8-ESOP; supplier_1: lcsc; supplier_1_partnumber: C16581; price: 0,2165; status: active
IC9 = 94: IC BATT MON LI-ION 1CELL 8X2QFN; manufacturer: Texas Instruments; id: 94; manufacturer_ref: BQ298012; type: Power Supply (Bat Prot); package: 8-XFQFN; supplier_1: digikey; supplier_1_partnumber: 296-BQ298012RUGRCT-ND; status: active
J5 = 18: as J3 on sheet MCU; package: Pin-2SR; price: 0
J9 = 59: CONN BAT 18650; manufacturer: KEESIN; id: 59; nbr_positions_total: 2; manufacturer_ref: B075TZF7NN; package: Pin-2SR; supplier_1: amazon; supplier_1_partnumber: B075TZF7NN; price: 0,978; status: active
L5 L6 = 14: FIXED IND 1UH 5.8A 26 MOHM SMD; manufacturer_ref: PA4332.102NLT; manufacturer: Pulse Electronics; id: 14; tolerance: 20%; current_rating: 5,8A; package: 4.2X4.2; supplier_1: digikey; supplier_1_partnumber: 553-3287-1-ND; price: 0,447; status: active
Q3 = 18: MOSFET 2N-CH 6CSP; manufacturer_ref: EFC8811R-TF; manufacturer: onsemi; id: 18; current_rating: 27A; voltage_vds: 12V; voltage_vgs_min: 1.3V; type: N channel; package: 6-SMD; supplier_1: digikey; supplier_1_partnumber: EFC8811R-TFOSCT-ND; status: active
R7 R71 = 39: RES SMD 46.4K OHM 1% 1/16W 0402; manufacturer_ref: AC0402FR-0746K4L; manufacturer: Yageo; id: 39; tolerance: 1%; power: 1/16W; package: 0402; supplier_1: digikey; supplier_1_partnumber: 13-AC0402FR-0746K4LCT-ND; price: 0,00296; status: active
R8 R62 R64 R69 R72 R73 = 8: as R5 on sheet MCU; power: 1/10W; package: 0402; supplier_1: digikey; supplier_1_partnumber: P0.0JCT-ND; price: 0,00487; status: active
R9 R14 R74 R75 = 7: RES SMD 100K OHM 1% 1/10W 0402; manufacturer_ref: ERJ-2RKF1003X; manufacturer: Panasonic Electronic Components; id: 7; tolerance: 1%; power: 1/10W; package: 0402; supplier_1: digikey; supplier_1_partnumber: P100KLCT-ND; price: 0,00735; status: active
R10 = 53: RES SMD 5K OHM 1% 1/16W 0402; manufacturer_ref: RC0402FR-075KL; manufacturer: Yageo; id: 53; tolerance: 1%; power: 1/16W; package: 0402; supplier_1: digikey; supplier_1_partnumber: 13-RC0402FR-075KLCT-ND; price: 0,00255; status: active
R11 R12 = 83: RES TH 100k OHM 5% 1/4W; manufacturer_ref: CR1/4W-100K±5%-RT52; manufacturer: VO; id: 83; tolerance: 5%; power: 1/4W; package: TH6.3; supplier_1: lcsc; supplier_1_partnumber: C2894520; price: 0,0038; status: active
R13 = 1: THERMISTOR NTC 10KOHM 3380K 0402; manufacturer_ref: NCP15XH103F03RC; manufacturer: Murata Electronics; id: 1; tolerance: 1%; power: 1/10W; type: NTC_THERMISTOR; package: 0402; supplier_1: digikey; supplier_1_partnumber: 490-4801-1-ND; price: 0,04977; status: active
R15 = 0: RES SMD 1K OHM 1% 1/10W 0402; manufacturer_ref: ERJ-2RKF1001X; manufacturer: Panasonic Electronic Components; id: 0; tolerance: 1%; power: 1/10W; package: 0402; supplier_1: digikey; supplier_1_partnumber: P1.00KLCT-ND; price: 0,00855; status: active
R16 = 55: CRGCQ 0402 27R 1%; manufacturer_ref: CRGCQ0402F27R; manufacturer: TE Connectivity Passive Product; id: 55; power: 1/16W; tolerance: 1%; package: 0402; supplier_1: digikey; supplier_1_partnumber: A129608CT-ND; price: 0,00331; status: active
R17 = 21: RES SMD 330 OHM 1% 1/10W 0402; manufacturer_ref: ERJ-2RKF3300X; manufacturer: Panasonic Electronic Components; id: 21; tolerance: 1%; power: 1/10W; package: 0402; supplier_1: digikey; supplier_1_partnumber: P330LCT-ND; price: 0,00648; status: active
R18 = 52: RES 2.2K OHM 5% 1/16W 0402; manufacturer_ref: RMCF0402JT2K20; manufacturer: Stackpole Electronics Inc; id: 52; tolerance: 5%; power: 1/16W; package: 0402; supplier_1: digikey; supplier_1_partnumber: RMCF0402JT2K20CT-ND; price: 0,00182; status: active
R20 = 28: RES 0.003 OHM 1% 1.5W 2010; manufacturer_ref: CSNL2010FT3L00; manufacturer: Stackpole Electronics Inc; id: 28; power: 3/2W; tolerance: 1%; package: 2010; supplier_1: digikey; supplier_1_partnumber: CSNL2010FT3L00CT-ND; price: 0,15695; status: active
S3 = 3: SWITCH TOGGLE SPDT 5A 120V; manufacturer: CIT Relay and Switch; id: 3; manufacturer_ref: ANT11SF1CQE; package: ANT11SF1CQE; supplier_1: digikey; supplier_1_partnumber: 2449-ANT11SF1CQE-ND; price: 1,98; status: active
TP1 = 1: Test point diameter 0.6mm; manufacturer_ref: Test Point 0.8MM; id: 1; type: Test Point; package: Test Point 0.8MM; supplier_3: 0; supplier_3_partnumber: 0; price: 0

## Sheet MOTOR.SchDoc: ROBOX V2 - Motor Controller
size A4; DrawnBy: Jan Stappers; Engineer: Jan Stappers; DocumentNumber: JSP016; Revision: B; SheetNumber: 5; SheetTotal: 6
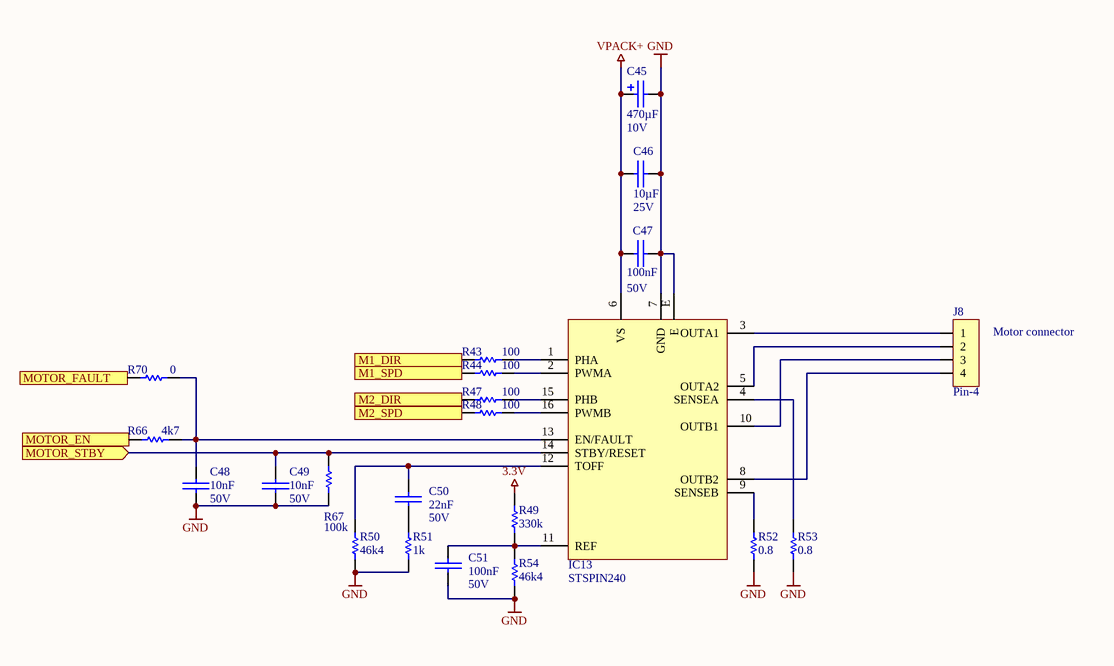
[diagram p4: MOTOR.SchDoc]

### Parts
C45  value 470µF  voltage: 10V  [CD6.3H12TH]  (hidden comment: cap-pol)
C46  value 10µF  voltage: 25V  [C0603]  (hidden comment: cap_non_pol)
C47  value 100nF  voltage: 50V  [C0402]  (hidden comment: cap_non_pol)
C48  value 10nF  voltage: 50V  [C0402]  (hidden comment: cap_non_pol)
C49  value 10nF  voltage: 50V  [C0402]  (hidden comment: cap_non_pol)
C50  value 22nF  voltage: 50V  [C0402]  (hidden comment: cap_non_pol)
C51  value 100nF  voltage: 50V  [TH5.08]  (hidden comment: cap_non_pol)
IC13  STSPIN240  [VFQFPN-16]
J8  Pin-4  [110990030]
R43  value 100  [R0402]  (hidden comment: resistor)
R44  value 100  [R0402]  (hidden comment: resistor)
R47  value 100  [R0402]  (hidden comment: resistor)
R48  value 100  [R0402]  (hidden comment: resistor)
R49  value 330k  [R0402]  (hidden comment: resistor)
R50  value 46k4  [R0402]  (hidden comment: resistor)
R51  value 1k  [R0402]  (hidden comment: resistor)
R52  value 0.8  [R1206]  (hidden comment: resistor)
R53  value 0.8  [R1206]  (hidden comment: resistor)
R54  value 46k4  [R0402]  (hidden comment: resistor)
R66  value 4k7  [R0402]  (hidden comment: resistor)
R67  value 100k  [R0402]  (hidden comment: resistor)
R70  value 0  [R0402]  (hidden comment: resistor)

### Ports
M1_DIR (in), M1_SPD (in), M2_DIR (in), M2_SPD (in), MOTOR_EN (in), MOTOR_FAULT (out), MOTOR_STBY (in)

### Nets
3.3V: R49.1
GND: C45.- C46.2 C47.1 C48.2 C49.2 C51.1 IC13.7(GND) IC13.E R50.2 R51.1 R52.1 R53.1 R54.2 R67.2
VPACK+: C45.+ C46.1 C47.2 IC13.6(VS)
NetC48_1: C48.1 IC13.13(EN/FAULT) R66.1 R70.1
NetC49_1: C49.1 IC13.14(STBY/RESET) R67.1 ; port MOTOR_STBY
NetC50_1: C50.1 R51.2
NetC50_2: C50.2 IC13.12(TOFF) R50.1
NetC51_2: C51.2 IC13.11(REF) R49.2 R54.1
NetIC3_25: R43.2 ; port M1_DIR
NetIC3_26: R47.2 ; port M2_DIR
NetIC3_33: R44.2 ; port M1_SPD
NetIC3_34: R48.2 ; port M2_SPD
NetIC10_15: R66.2 ; port MOTOR_EN
NetIC10_17: R70.2 ; port MOTOR_FAULT
NetIC13_1: IC13.1(PHA) R43.1
NetIC13_2: IC13.2(PWMA) R44.1
NetIC13_3: IC13.3(OUTA1) J8.1
NetIC13_4: IC13.4(SENSEA) R53.2
NetIC13_5: IC13.5(OUTA2) J8.2
NetIC13_8: IC13.8(OUTB2) J8.4
NetIC13_9: IC13.9(SENSEB) R52.2
NetIC13_10: IC13.10(OUTB1) J8.3
NetIC13_15: IC13.15(PHB) R47.1
NetIC13_16: IC13.16(PWMB) R48.1

### Notes on the sheet
- (near J8) Motor connector
- Title
- Size:
- Date:
- A4
- Number:
- Time:
- Revision:
- Sheet
- of
- File:

### Library data of the parts
C45 = 4: as C1 on sheet AUDIO; tolerance: 20%; package: d6.3h12TH; supplier_1: lcsc; supplier_1_partnumber: C2924460; price: 0,0391; status: active
C46 = 1: as C10 on sheet MCU; tolerance: 10%; dielectric: X5R; package: 0603; supplier_1: digikey; supplier_1_partnumber: 490-18214-1-ND; price: 0,06969; status: active
C47 = 0: as C11 on sheet MCU; dielectric: X5R; package: 0402; supplier_1: digikey; supplier_1_partnumber: 490-16356-1-ND; price: 0,00933; status: non stock
C48 C49 = 7: CAP CER 10000PF 50V X7R 0402; manufacturer_ref: CL05B103KB5NNNC; manufacturer: Samsung Electro-Mechanics; id: 7; tolerance: 10%; dielectric: X7R; package: 0402; supplier_1: digikey; supplier_1_partnumber: 1276-1028-1-ND; price: 0,00333; status: active
C50 = 53: CAP CER 0.022UF 50V X7R 0402; manufacturer_ref: GRM155R71H223KA12D; manufacturer: Murata Electronics; id: 53; tolerance: 10%; dielectric: X7R; package: 0402; supplier_1: digikey; supplier_1_partnumber: 490-3884-1-ND; price: 0,09; status: active
C51 = 51: as C13 on sheet MCU; dielectric: X7R; package: TH5.08; supplier_1: lcsc; supplier_1_partnumber: C385200; price: 0,0237; status: active
IC13 = 81: IC HALF BRIDGE DRV 1.3A 16VFQFPN; manufacturer: STMicroelectronics; id: 81; manufacturer_ref: STSPIN240; type: MISC (Motor Driver); package: 16-VFQFPN; supplier_1: digikey; supplier_1_partnumber: 497-16604-1-ND; status: active
J8 = 58: as J1 on sheet AUDIO; manufacturer_ref: 110990030; package: Pin-4SR; supplier_1: digikey; supplier_1_partnumber: 1597-1082-ND; price: 0,157; status: active
R43 R44 R47 R48 = 29: as R6 on sheet MCU; tolerance: 1%; power: 1/5W; package: 0402; supplier_1: digikey; supplier_1_partnumber: 541-100YCT-ND; price: 0,01933; status: active
R49 = 65: RES 330K OHM 1% 1/16W 0402; manufacturer_ref: RC0402FR-13330KL; manufacturer: YAGEO; id: 65; tolerance: 1%; power: 1/16W; package: 0402; supplier_1: digikey; supplier_1_partnumber: 13-RC0402FR-13330KLCT-ND; price: 0,013; status: active
R50 R54 = 39: as R7 on sheet PSU; tolerance: 1%; power: 1/16W; package: 0402; supplier_1: digikey; supplier_1_partnumber: 13-AC0402FR-0746K4LCT-ND; price: 0,00296; status: active
R51 = 0: as R15 on sheet PSU; tolerance: 1%; power: 1/10W; package: 0402; supplier_1: digikey; supplier_1_partnumber: P1.00KLCT-ND; price: 0,00855; status: active
R52 R53 = 92: RES 0.002 OHM 1% 1W 1206; manufacturer_ref: D1MPC1206DR002FF-T5; manufacturer: Thin Film Technology Corp.; id: 92; tolerance: 1%; power: 1W; package: 1206; supplier_1: digikey; supplier_1_partnumber: 4463-D1MPC1206DR002FF-T5TR-ND; price: 0,33; status: active
R66 = 1: RES SMD 4.7K OHM 1% 1/10W 0402; manufacturer_ref: ERJ-2RKF4701X; manufacturer: Panasonic Electronic Components; id: 1; tolerance: 1%; power: 1/10W; package: 0402; supplier_1: digikey; supplier_1_partnumber: P4.70KLCT-ND; price: 0,00901; status: active
R67 = 7: as R9 on sheet PSU; tolerance: 1%; power: 1/10W; package: 0402; supplier_1: digikey; supplier_1_partnumber: P100KLCT-ND; price: 0,00735; status: active
R70 = 8: as R5 on sheet MCU; power: 1/10W; package: 0402; supplier_1: digikey; supplier_1_partnumber: P0.0JCT-ND; price: 0,00487; status: active

## Sheet GIO.SchDoc: ROBOX V2 - General Input Output
size A4; DrawnBy: Jan Stappers; DocumentNumber: JSP016; Revision: B; SheetNumber: 6; SheetTotal: 6
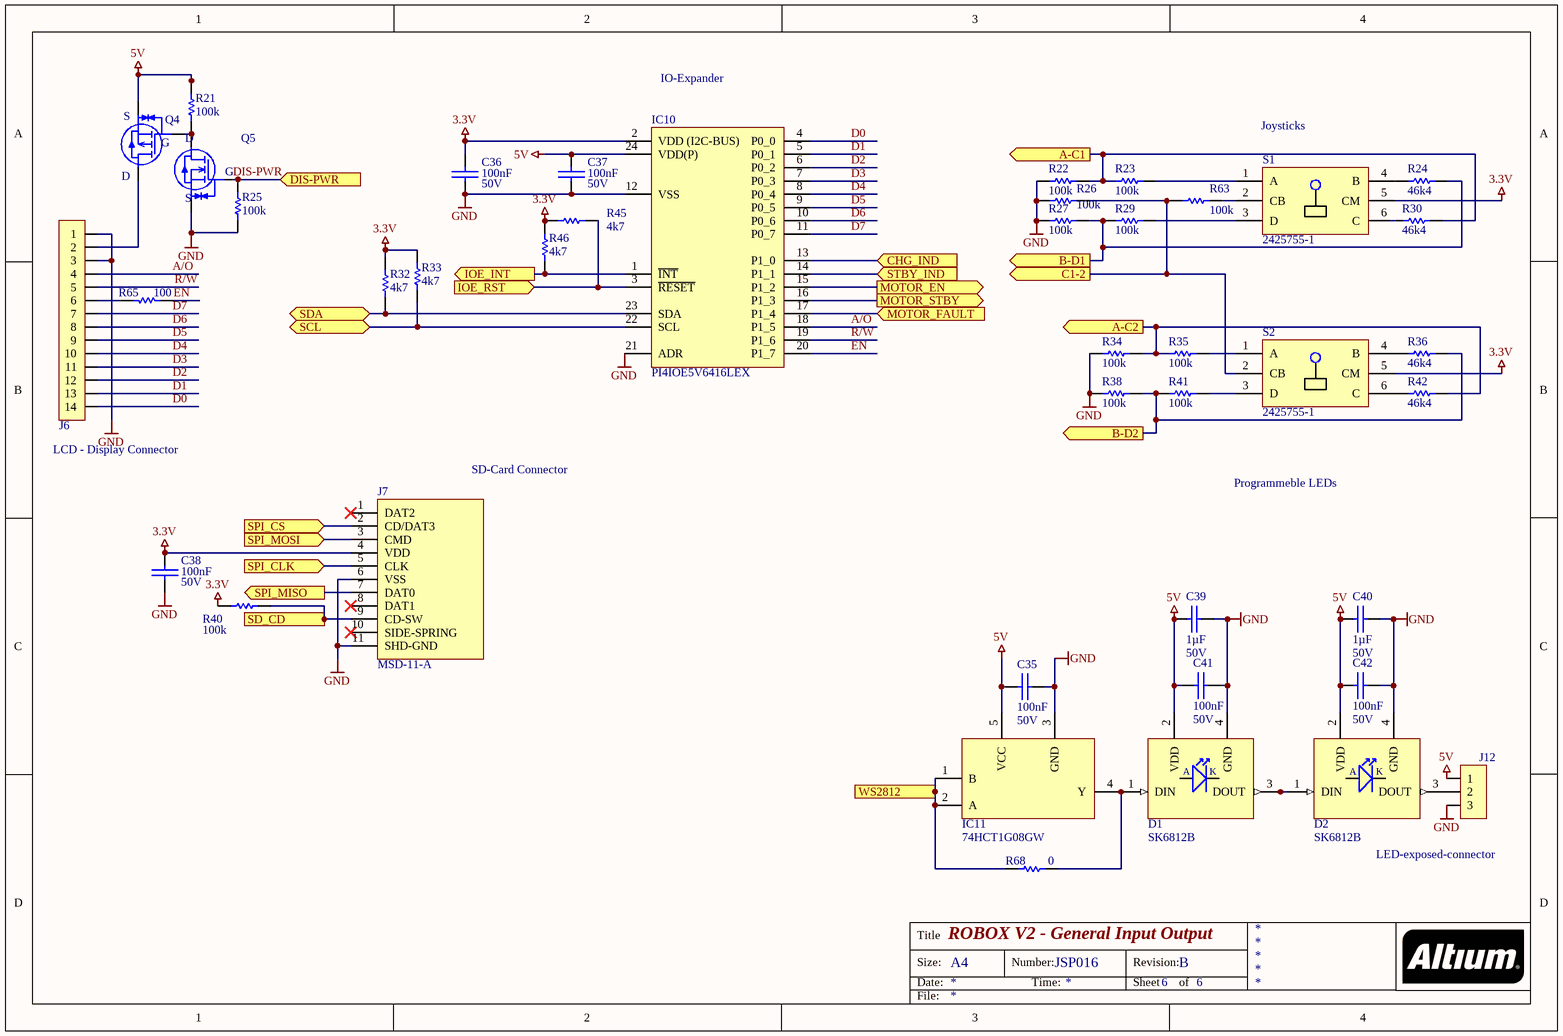
[diagram p5: GIO.SchDoc]

### Parts
C35  value 100nF  voltage: 50V  [TH5.08]  (hidden comment: cap_non_pol)
C36  value 100nF  voltage: 50V  [C0402]  (hidden comment: cap_non_pol)
C37  value 100nF  voltage: 50V  [C0402]  (hidden comment: cap_non_pol)
C38  value 100nF  voltage: 50V  [C0402]  (hidden comment: cap_non_pol)
C39  value 1µF  voltage: 50V  [TH5.08]  (hidden comment: cap_non_pol)
C40  value 1µF  voltage: 50V  [TH5.08]  (hidden comment: cap_non_pol)
C41  value 100nF  voltage: 50V  [TH5.08]  (hidden comment: cap_non_pol)
C42  value 100nF  voltage: 50V  [TH5.08]  (hidden comment: cap_non_pol)
D1  SK6812B  [SK6812B]
D2  SK6812B  [SK6812B]
IC10  PI4IOE5V6416LEX  [TSSOP-24]
IC11  74HCT1G08GW  [TSSOP-5]
J6  Pin-14  [HLW14S-2C7LF]  (value not drawn)
J7  MSD-11-A  [MSD-11-A]
J12  Pin-3  [3-PIN-EMPTY]  (value not drawn)
Q4  P_CH_MOSFET2  [SOT-323]  (value not drawn)
Q5  N_CH_MOSFET  [SOT-23(-3)]  (value not drawn)
R21  value 100k  [R0402]  (hidden comment: resistor)
R22  value 100k  [R0402]  (hidden comment: resistor)
R23  value 100k  [R0402]  (hidden comment: resistor)
R24  value 46k4  [R0402]  (hidden comment: resistor)
R25  value 100k  [R0402]  (hidden comment: resistor)
R26  value 100k  [R0402]  (hidden comment: resistor)
R27  value 100k  [R0402]  (hidden comment: resistor)
R29  value 100k  [R0402]  (hidden comment: resistor)
R30  value 46k4  [R0402]  (hidden comment: resistor)
R32  value 4k7  [R0402]  (hidden comment: resistor)
R33  value 4k7  [R0402]  (hidden comment: resistor)
R34  value 100k  [R0402]  (hidden comment: resistor)
R35  value 100k  [R0402]  (hidden comment: resistor)
R36  value 46k4  [R0402]  (hidden comment: resistor)
R38  value 100k  [R0402]  (hidden comment: resistor)
R40  value 100k  [R0402]  (hidden comment: resistor)
R41  value 100k  [R0402]  (hidden comment: resistor)
R42  value 46k4  [R0402]  (hidden comment: resistor)
R45  value 4k7  [R0402]  (hidden comment: resistor)
R46  value 4k7  [R0402]  (hidden comment: resistor)
R63  value 100k  [R0402]  (hidden comment: resistor)
R65  value 100  [R0402]  (hidden comment: resistor)
R68  value 0  [R0402]  (hidden comment: resistor)
S1  2425755-1  [2425755-1]
S2  2425755-1  [2425755-1]

### Ports
A-C1 (out), A-C2 (out), B-D1 (out), B-D2 (out), C1-2 (out), CHG_IND (in), DIS-PWR (in), IOE_INT (out), IOE_RST (in), MOTOR_EN (out), MOTOR_FAULT (in), MOTOR_STBY (out), SCL (bidir), SD_CD (out), SDA (bidir), SPI_CLK (in), SPI_CS (in), SPI_MISO (out), SPI_MOSI (in), STBY_IND (in), WS2812 (in)

### Nets
3.3V: C36.2 C38.2 IC10.2(VDD_(I2C-BUS)) J7.4(VDD) R32.2 R33.2 R40.2 R45.2 R46.2 S1.5(CM) S2.5(CM)
5V: C35.1 C37.2 C39.2 C40.2 C41.1 C42.1 D1.2(VDD) D2.2(VDD) IC10.24(VDD(P)) IC11.5(VCC) J12.1 Q4.S R21.1
GND: C35.2 C36.1 C37.1 C38.1 C39.1 C40.1 C41.2 C42.2 D1.4(GND) D2.4(GND) IC10.12(VSS) IC10.21(ADR) IC11.3(GND) J6.1 J6.3 J7.6(VSS) J7.11(SHD-GND) J12.3 Q5.2(S) R22.2 R25.2 R26.2 R27.2 R34.2 R38.2
A/O: IC10.18(P1_5) J6.4
D0: IC10.4(P0_0) J6.14
D1: IC10.5(P0_1) J6.13
D2: IC10.6(P0_2) J6.12
D3: IC10.7(P0_3) J6.11
D4: IC10.8(P0_4) J6.10
D5: IC10.9(P0_5) J6.9
D6: IC10.10(P0_6) J6.8
D7: IC10.11(P0_7) J6.7
DIS-PWR: Q5.1(G) R25.1 ; port DIS-PWR
EN: IC10.20(P1_7) R65.2
R/W: IC10.19(P1_6) J6.5
NetC49_1: IC10.16(P1_3) ; port MOTOR_STBY
NetD1_1: D1.1(DIN) IC11.4(Y) R68.1
NetD1_3: D1.3(DOUT) D2.1(DIN)
NetD2_3: D2.3(DOUT) J12.2
NetIC3_4: R26.1 R63.2 S2.2(CB) ; port C1-2
NetIC3_5: R34.1 R35.2 R42.1 ; port A-C2
NetIC3_6: R36.1 R38.1 R41.2 ; port B-D2
NetIC3_7: IC10.1(~{INT}) R46.1 ; port IOE_INT
NetIC3_9: R22.1 R23.2 R30.1 ; port A-C1
NetIC3_10: R24.1 R27.1 R29.2 ; port B-D1
NetIC3_22: J7.9(CD-SW) R40.1 ; port SD_CD
NetIC3_29: J7.2(CD/DAT3) ; port SPI_CS
NetIC3_30: J7.5(CLK) ; port SPI_CLK
NetIC3_31: J7.3(CMD) ; port SPI_MOSI
NetIC3_32: J7.7(DAT0) ; port SPI_MISO
NetIC8_6: IC10.14(P1_1) ; port STBY_IND
NetIC8_7: IC10.13(P1_0) ; port CHG_IND
NetIC10_3: IC10.3(~{RESET}) R45.1 ; port IOE_RST
NetIC10_15: IC10.15(P1_2) ; port MOTOR_EN
NetIC10_17: IC10.17(P1_4) ; port MOTOR_FAULT
NetIC10_22: IC10.22(SCL) R33.1 ; port SCL
NetIC10_23: IC10.23(SDA) R32.1 ; port SDA
NetIC11_1: IC11.1(B) IC11.2(A) R68.2 ; port WS2812
NetJ6_2: J6.2 Q4.D
NetJ6_6: J6.6 R65.1
NetQ4_G: Q4.G Q5.3(D) R21.2
NetR23_1: R23.1 S1.1(A)
NetR24_2: R24.2 S1.4(B)
NetR29_1: R29.1 S1.3(D)
NetR30_2: R30.2 S1.6(C)
NetR35_1: R35.1 S2.1(A)
NetR36_2: R36.2 S2.4(B)
NetR41_1: R41.1 S2.3(D)
NetR42_2: R42.2 S2.6(C)
NetR63_1: R63.1 S1.2(CB)

Not connected (* = marked no-connect by the designer): J7 1(DAT2)* 8(DAT1)* 10(SIDE-SPRING)*

### Notes on the sheet
- IO-Expander
- (near S1) Joysticks
- (near J6) LCD - Display Connector
- SD-Card Connector
- Programmeble LEDs
- LED-exposed-connector
- Title
- Size:
- Date:
- A4
- Number:
- Time:
- Revision:
- Sheet
- of
- File:
- (in symbol 86) A; K

### Library data of the parts
C35 C41 C42 = 51: as C13 on sheet MCU; dielectric: X7R; package: TH5.08; supplier_1: lcsc; supplier_1_partnumber: C385200; price: 0,0237; status: active
C36-C38 = 0: as C11 on sheet MCU; dielectric: X5R; package: 0402; supplier_1: digikey; supplier_1_partnumber: 490-16356-1-ND; price: 0,00933; status: non stock
C39 C40 = 49: CAP CER TH 1µF X7R 50V; manufacturer_ref: CD1H105MC9BEF4E000; manufacturer: Dersonic; id: 49; tolerance: 20%; dielectric: X7R; package: TH5.08; supplier_1: lcsc; supplier_1_partnumber: C263189; price: 0,0235; status: active
D1 D2 = 86: ADDRESS LED DISCRETE RGB 4X2MM; manufacturer_ref: WS2812-SIDE; manufacturer: Adafruit Industries LLC; id: 86; type: ADDRESSABLE LED; package: SK6812B; supplier_1: digikey/mouser; supplier_1_partnumber: 1528-4691-ND/485-4691; price: 0,365; status: active
IC10 = 83: IC XPNDR 400KHZ I2C 24TSSOP; manufacturer: Diodes Incorporated; id: 83; manufacturer_ref: PI4IOE5V6416LEX; type: Wired (Expander); package: 24-TSSOP; supplier_1: digikey; supplier_1_partnumber: PI4IOE5V6416LEXDICT-ND; price: 0,869; status: active
IC11 = 95: IC GATE AND 1CH 2-INP 5TSSOP; manufacturer: Nexperia USA Inc.; id: 95; manufacturer_ref: 74HCT1G08GW; type: Logic Gate (AND); package: 5-TSSOP; supplier_1: digikey; supplier_1_partnumber: 1727-6053-1-ND; price: 0,269; status: active
J6 = 57: CONN FFC FPC VERT 14POS 1MM PCB; manufacturer: Amphenol ICC (FCI); id: 57; nbr_positions_total: 14; manufacturer_ref: HLW14S-2C7LF; package: Pin-14SR; supplier_1: digikey; supplier_1_partnumber: 609-1827-ND; price: 0,21; status: active
J7 = 56: MICRO SD CARD CONNECTOR, 8 POSIT; manufacturer: CUI Devices; id: 56; nbr_positions_total: 11; manufacturer_ref: MSD-11-A; package: µsd; supplier_1: digikey; supplier_1_partnumber: 2223-MSD-11-ACT-ND; status: active
J12 = 61: CONN TH solder pad; manufacturer_ref: 3-Pin TH; id: 61; nbr_positions_total: 3; package: Pin-3SR; price: 0; status: active
Q4 = 14: MOSFET P-CH 20V 820MA SOT323; manufacturer_ref: DMG1013UW-7; manufacturer: Diodes Incorporated; id: 14; current_rating: 0.820A; voltage_vgs_min: -0.5V; type: P channel; voltage_vds: 20V; package: SOT-323; supplier_1: digikey; supplier_1_partnumber: DMG1013UW-7DICT-ND; price: 0,06792; status: active
Q5 = 7: as Q1 on sheet MCU; voltage_vds: 100V; package: SOT23-3; supplier_1: digikey; supplier_1_partnumber: NTR4003NT1GOSCT-ND; price: 0,0395; status: active
R21-R23 R25-R27 R29 R34 R35 R38 R40 R41 R63 = 7: as R9 on sheet PSU; tolerance: 1%; power: 1/10W; package: 0402; supplier_1: digikey; supplier_1_partnumber: P100KLCT-ND; price: 0,00735; status: active
R24 R30 R36 R42 = 39: as R7 on sheet PSU; tolerance: 1%; power: 1/16W; package: 0402; supplier_1: digikey; supplier_1_partnumber: 13-AC0402FR-0746K4LCT-ND; price: 0,00296; status: active
R32 R33 R45 R46 = 1: as R66 on sheet MOTOR; tolerance: 1%; power: 1/10W; package: 0402; supplier_1: digikey; supplier_1_partnumber: P4.70KLCT-ND; price: 0,00901; status: active
R65 = 29: as R6 on sheet MCU; tolerance: 1%; power: 1/5W; package: 0402; supplier_1: digikey; supplier_1_partnumber: 541-100YCT-ND; price: 0,01933; status: active
R68 = 8: as R5 on sheet MCU; power: 1/10W; package: 0402; supplier_1: digikey; supplier_1_partnumber: P0.0JCT-ND; price: 0,00487; status: active
S1 S2 = 2: SWITCH NAVIGATION DGTL 50MA 12V; manufacturer: TE Connectivity; id: 2; manufacturer_ref: 2425755-1; package: 2425755-1; supplier_1: digikey; supplier_1_partnumber: 450-2425755-1CT-ND; price: 0,25000; status: active

## Nets that join several sheets
3.3V: MCU (10 pins), PSU (R8.1 R11.1 R12.1), MOTOR (R49.1), GIO (11 pins)
5V: PSU (13 pins), GIO (13 pins)
5V-B: AUDIO (11 pins), PSU (J5.2 R69.1 R72.1 R73.1)
GND: MCU (41 pins), AUDIO (17 pins), PSU (33 pins), MOTOR (14 pins), GIO (25 pins)
VBUS: MCU (J2.A4B9 J2.B4A9), PSU (5 pins)
VPACK+: PSU (15 pins), MOTOR (C45.+ C46.1 C47.2 IC13.6)
DIS-PWR: MCU (R31.1), GIO (Q5.1 R25.1)
NetC34_2: MCU (R39.1), PSU (C34.2 R74.2 R75.1)
NetC49_1: MOTOR (C49.1 IC13.14 R67.1), GIO (IC10.16)
NetIC1_1: MCU (IC3.11), AUDIO (IC1.1 IC2.1)
NetIC1_4: MCU (IC3.20), AUDIO (IC1.4 R1.2)
NetIC1_14: MCU (IC3.13), AUDIO (IC1.14 IC2.14)
NetIC1_16: MCU (IC3.12), AUDIO (IC1.16 IC2.16)
NetIC3_4: MCU (IC3.4), GIO (R26.1 R63.2 S2.2)
NetIC3_5: MCU (IC3.5), GIO (R34.1 R35.2 R42.1)
NetIC3_6: MCU (IC3.6), GIO (R36.1 R38.1 R41.2)
NetIC3_7: MCU (IC3.7), GIO (IC10.1 R46.1)
NetIC3_9: MCU (IC3.9), GIO (R22.1 R23.2 R30.1)
NetIC3_10: MCU (IC3.10), GIO (R24.1 R27.1 R29.2)
NetIC3_22: MCU (IC3.22), GIO (J7.9 R40.1)
NetIC3_25: MCU (IC3.25), MOTOR (R43.2)
NetIC3_26: MCU (IC3.26), MOTOR (R47.2)
NetIC3_29: MCU (IC3.29), GIO (J7.2)
NetIC3_30: MCU (IC3.30), GIO (J7.5)
NetIC3_31: MCU (IC3.31), GIO (J7.3)
NetIC3_32: MCU (IC3.32), GIO (J7.7)
NetIC3_33: MCU (IC3.33), MOTOR (R44.2)
NetIC3_34: MCU (IC3.34), MOTOR (R48.2)
NetIC8_6: PSU (IC8.6 R11.2), GIO (IC10.14)
NetIC8_7: PSU (IC8.7 R12.2), GIO (IC10.13)
NetIC10_3: MCU (R37.1), GIO (IC10.3 R45.1)
NetIC10_15: MOTOR (R66.2), GIO (IC10.15)
NetIC10_17: MOTOR (R70.2), GIO (IC10.17)
NetIC10_22: MCU (R28.2), GIO (IC10.22 R33.1)
NetIC10_23: MCU (R6.2), GIO (IC10.23 R32.1)
NetIC11_1: MCU (R57.1), GIO (IC11.1 IC11.2 R68.2)

## Assembly variants
Variant of JSP016RB: not fitted C23 C24 C25 C26 C27 C28 C29 IC7 J5 L6 R9 R68 R71
JSP016RB_NO_TH_COMP: not fitted C1 C4 C5 C8 C9 C13 C23 C24 C25 C26 C27 C28 C29 C30 C33 C35 C39 C40 C41 C42 C45 C51 IC7 J1 J5 J6 J8 J9 L6 R9 R11 R12 R68 R71